# EAGLE design irisc (EAGLE 9.2.2)
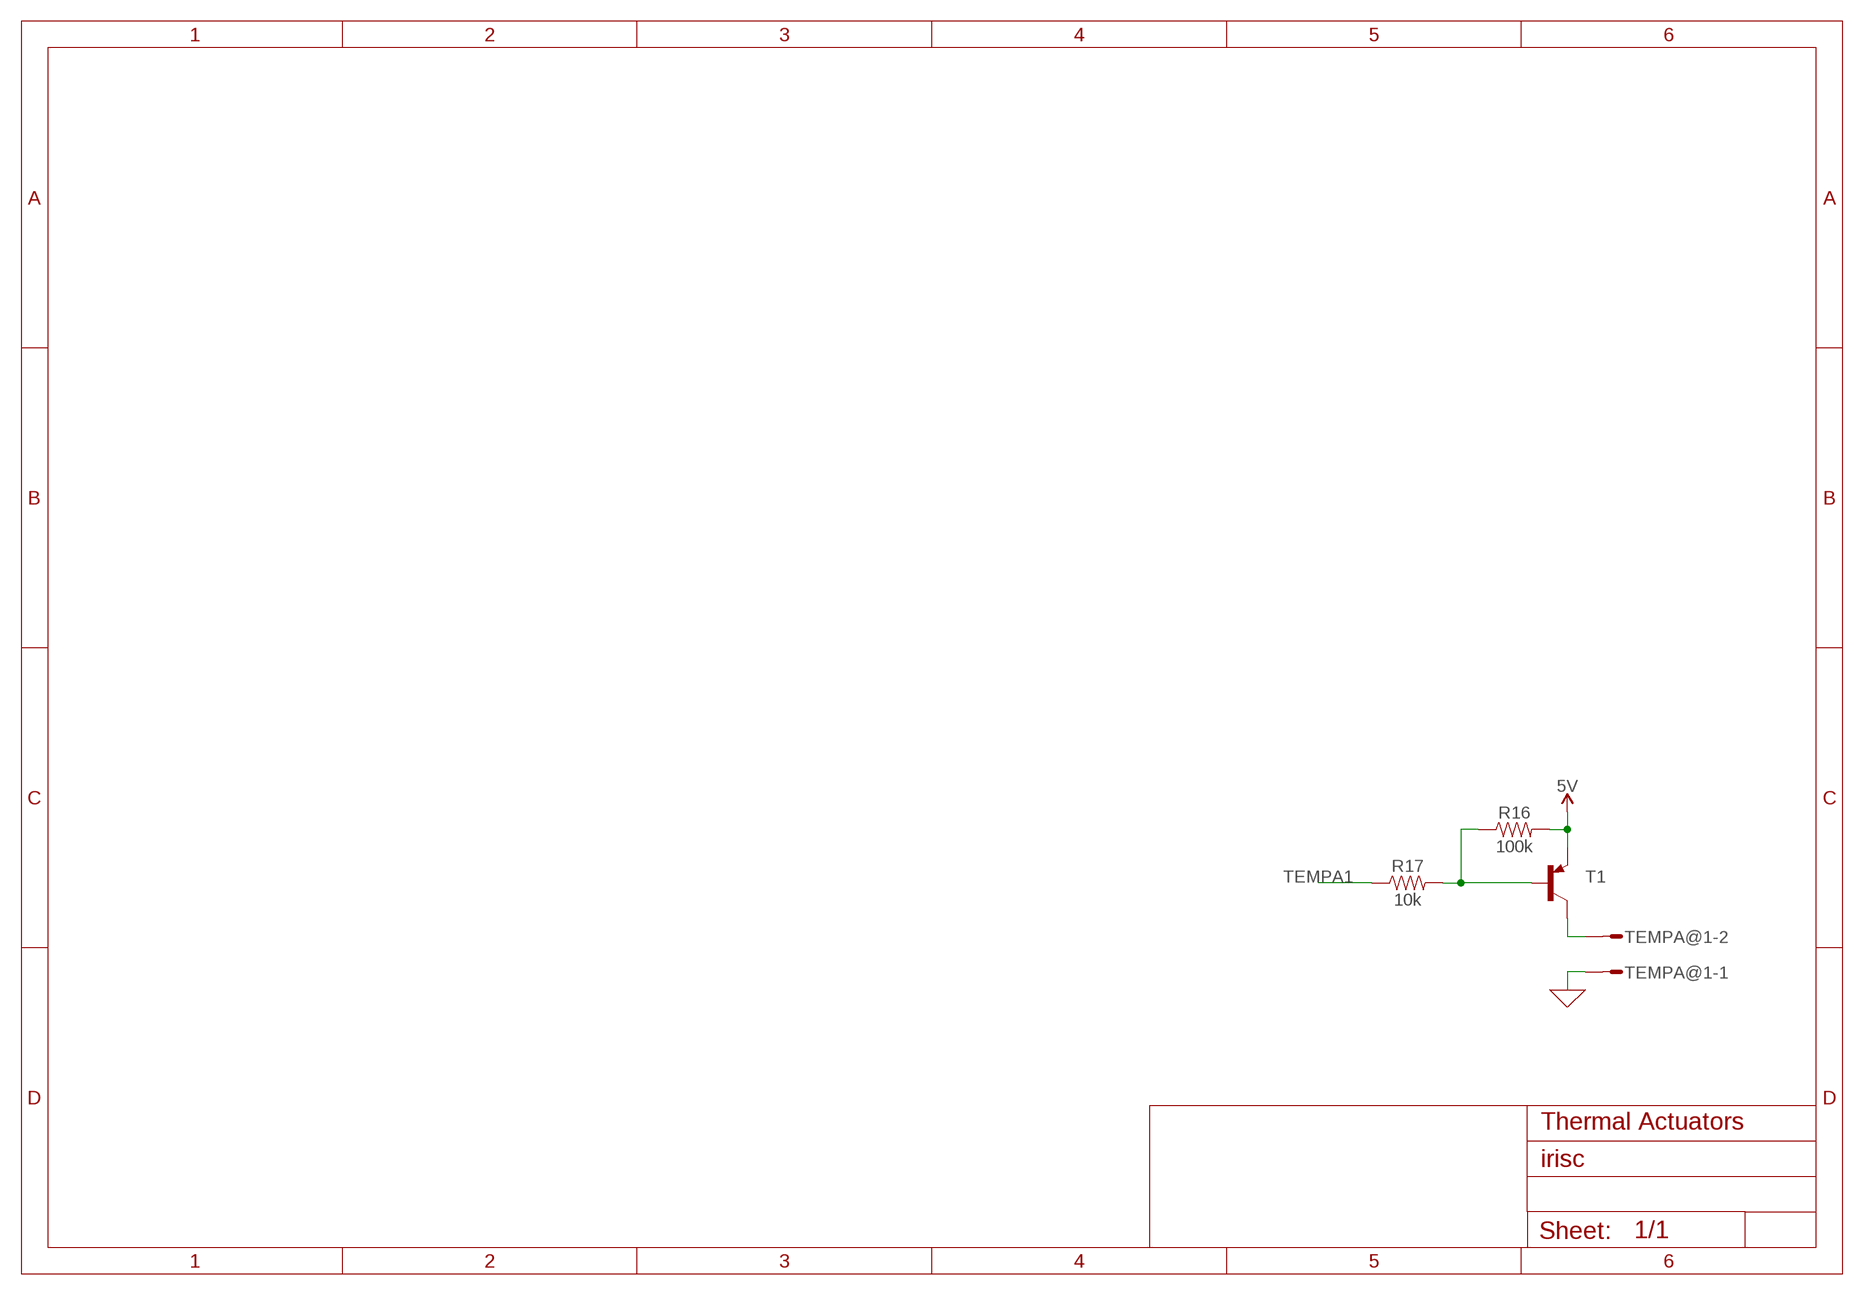
[diagram p0: schematic, sheet 1]

## Parts
R16  100k  100KOHM-0603-1/10W-1%  [0603]
R17  10k  100KOHM-0603-1/10W-1%  [0603]
T1  -PNP-SOT23-BEC  [SOT23-BEC]
TEMPA@1  L02P  [L02P]

## Nets
0: TEMPA@1.1 ; supply symbol labelled GND
5V: R16.2 T1.E
N$65: R16.1 R17.2 T1.B
N$69: T1.C TEMPA@1.2
TEMPA1: R17.1

## Notes on the sheet
- Thermal Actuators

## Library data of the parts
R16 = SparkFun-Resistors:100KOHM: 100kΩ resistor A resistor is a passive two-terminal electrical component that implements electrical resistance as a circuit element. Resistors act to reduce current flow, and, at the same time, act to lower voltage levels within circuits. - Wikipedia; PROD_ID: RES-07828
R17 = SparkFun-Resistors:100KOHM: 100kΩ resistor A resistor is a passive two-terminal electrical component that implements electrical resistance as a circuit element. Resistors act to reduce current flow, and, at the same time, act to lower voltage levels within circuits. - Wikipedia; PROD_ID: RES-07828; VALUE: 100k
T1 = DC_LOAD_AU:*-PNP-: PNP Transistror
TEMPA@1 = con-amp-mt:L02P: AMP MT CONNECTOR; OC_FARNELL: unknown; OC_NEWARK: unknown

## Board
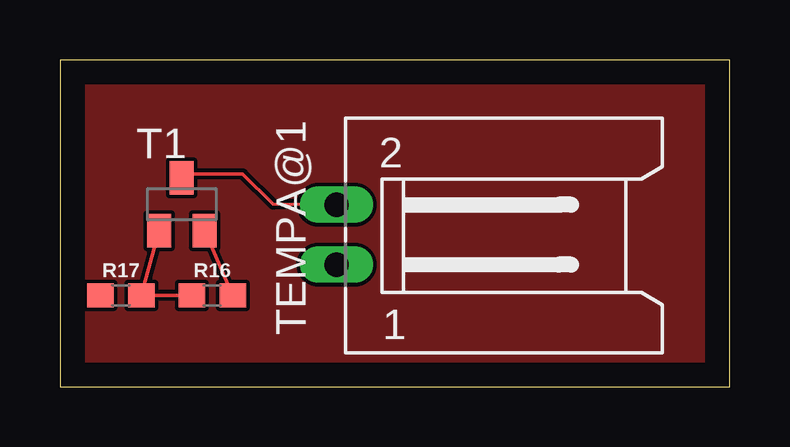
[diagram p1: board, top side]

Size 27.92 x 13.64 mm. Coordinates in mm from the lower left corner, seen from the top.
Outline: 0,0 27.92,0 27.92,13.64 0,13.64 0,0
Copper layers (1*16): Top 0.035mm / dielectric 1.5mm / Bottom 0.035mm
Design rules "default": minimum track width 6mil, minimum drill 0.35mm, track to track 6mil, track to pad 6mil, pad to pad 6mil, via to via 6mil, smd to smd 6mil, copper to edge 40mil, drill to drill 6mil, minimum pad ring 10mil, minimum via ring 8mil, stop-mask expansion 4mil, vias tented up to drill 0mil, thermal gap 10mil

### Footprints (pad centres in the part's own frame; a part is rotated, then mirrored left to right if it is on the bottom)
0603 = smd 1.1 x 1: 1 -0.85,0; 2 0.85,0
SOT23-BEC = smd 1 x 1.4: B -0.95,-1.1; C 0,1.1; E 0.95,-1.1
L02P = drill 1.016 long: 1 1.25,-6.25; 2 -1.25,-6.25

### Placement (x,y rotation side)
R16  6.35,3.81 0 top
R17  2.54,3.81 0 top
T1  5.08,7.62 0 top
TEMPA@1  17.78,6.35 270 top

### Tracks (layer width: path | path; a pad name or v marks a point on that pad's centre or on a via)
5V
  Top 0.152: R16.2 T1.E
GND
  pour Top: 0,0 27.94,0 27.94,13.97 0,13.97
N$65
  Top 0.152: R16.1 R17.2 T1.B
N$69
  Top 0.152: TEMPA@1.2 8.89,7.62 7.62,8.89 5.08,8.89 T1.C